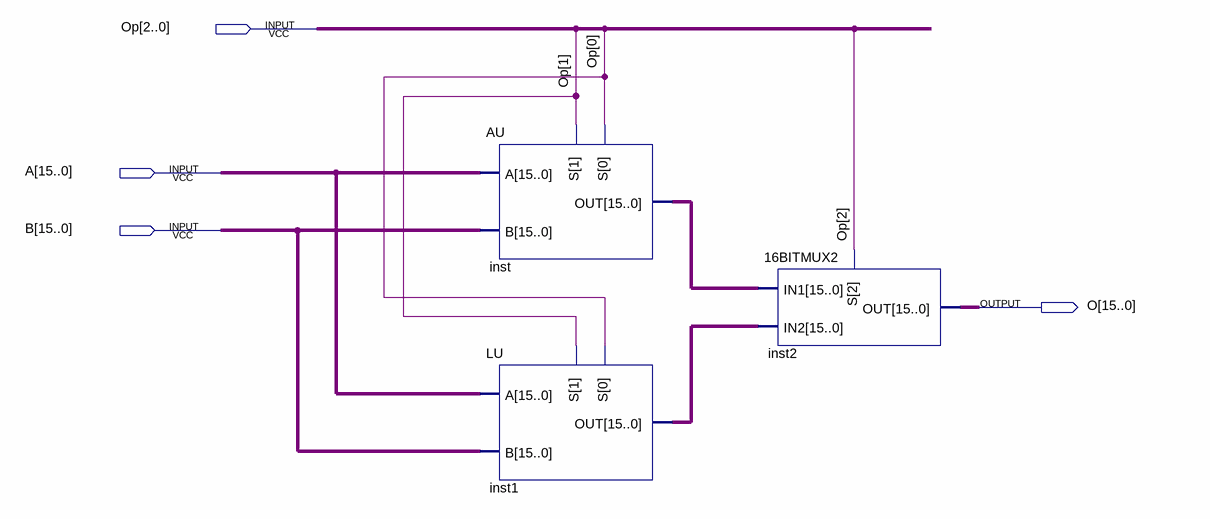
[diagram p0: schematic sheet]
// Quartus schematic ALU16BIT.bdf as structural Verilog: 3 symbols, 4 pins
module ALU16BIT (
  input  [2:0] Op,
  input  [15:0] A,
  input  [15:0] B,
  output [15:0] O
);

  wire [15:0] inst1_out, inst_out;

  AU inst (.S(Op[1:0]), .A(A), .B(B), .OUT(inst_out));
  LU inst1 (.S(Op[1:0]), .A(A), .B(B), .OUT(inst1_out));
  \16BITMUX2  inst2 (.IN1(inst_out), .IN2(inst1_out), .S(Op[2]), .OUT(O));
endmodule
